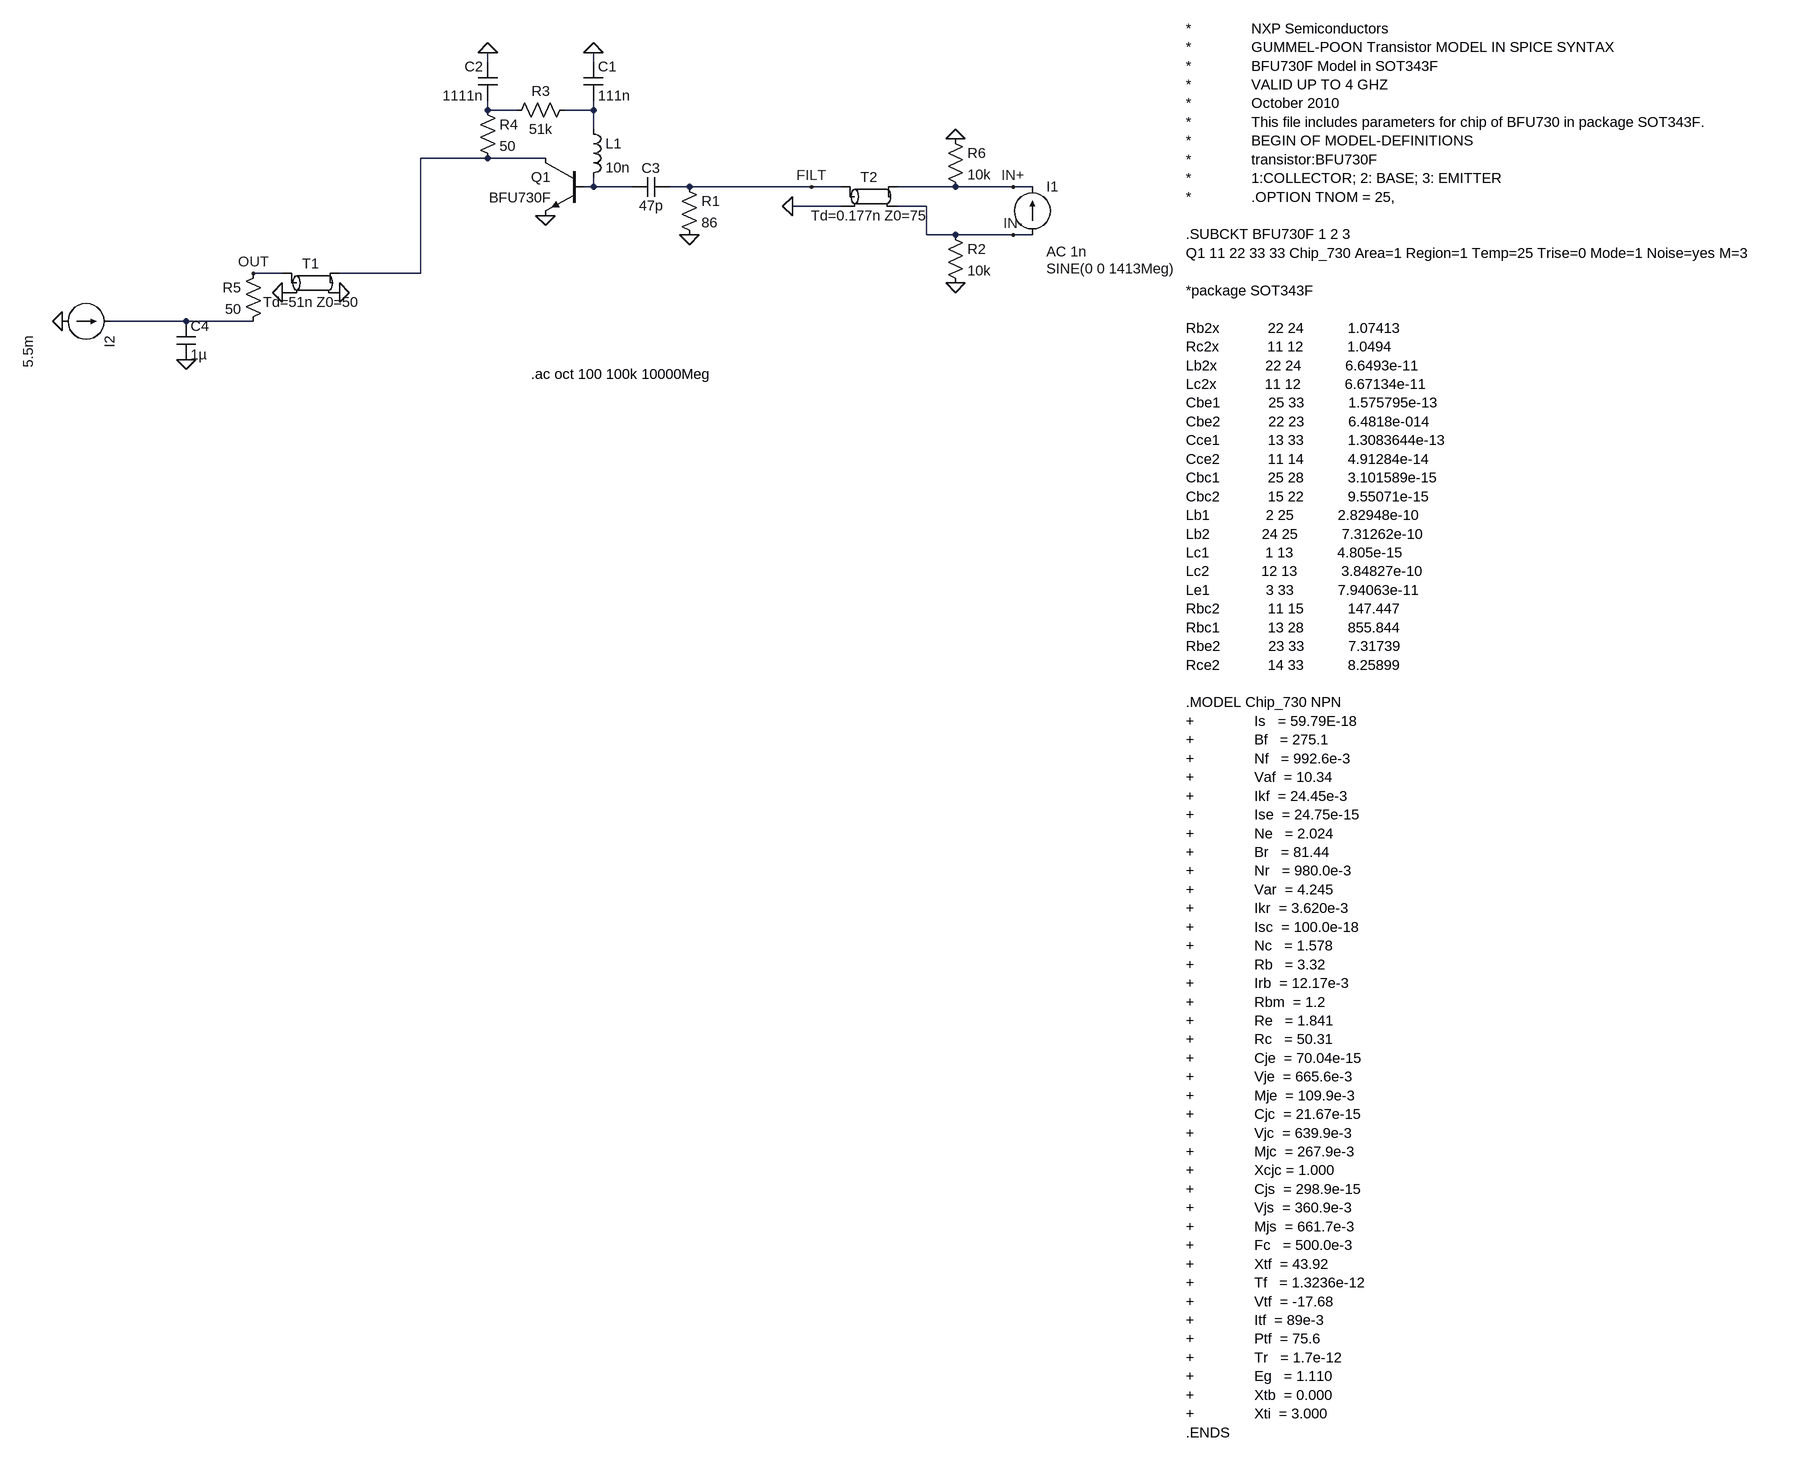
[diagram p0: schematic antenna_lna.asc]
antenna_lna.asc, the LTspice schematic file:
Version 4
SHEET 1 2580 2072
WIRE -304 -64 -304 -80
WIRE -128 -64 -128 -80
WIRE -304 16 -304 0
WIRE -256 16 -304 16
WIRE -128 16 -128 0
WIRE -128 16 -176 16
WIRE -128 48 -128 16
WIRE -304 96 -416 96
WIRE -208 96 -304 96
WIRE -128 144 -128 128
WIRE -128 144 -144 144
WIRE -64 144 -128 144
WIRE 32 144 0 144
WIRE 304 144 32 144
WIRE 352 144 304 144
WIRE 544 144 448 144
WIRE 640 144 544 144
WIRE 672 144 640 144
WIRE 352 176 272 176
WIRE 496 176 448 176
WIRE 496 224 496 176
WIRE 544 224 496 224
WIRE 640 224 544 224
WIRE 672 224 640 224
WIRE -672 288 -720 288
WIRE -416 288 -416 96
WIRE -416 288 -576 288
WIRE -832 368 -992 368
WIRE -720 368 -832 368
FLAG -208 192 0
FLAG -1072 368 0
FLAG -672 320 0
FLAG -576 320 0
FLAG -720 288 OUT
FLAG 304 144 FILT
FLAG 544 304 0
FLAG 544 64 0
FLAG 272 176 0
FLAG 32 224 0
FLAG -832 432 0
FLAG -128 -80 0
FLAG -304 -80 0
FLAG 640 144 IN+
FLAG 640 224 IN-
SYMBOL npn -144 96 M0
WINDOW 3 54 66 Left 2
SYMATTR InstName Q1
SYMATTR Value BFU730F
SYMATTR Prefix XN
SYMBOL res -704 272 M0
SYMATTR InstName R5
SYMATTR Value 50
SYMBOL tline -624 304 R0
SYMATTR InstName T1
SYMATTR Value Td=51n Z0=50
SYMBOL current 672 224 M180
WINDOW 0 24 80 Left 2
WINDOW 3 24 -56 Left 2
WINDOW 123 24 -28 Left 2
WINDOW 39 0 0 Left 0
SYMATTR InstName I1
SYMATTR Value SINE(0 0 1413Meg)
SYMATTR Value2 AC 1n
SYMBOL tline 400 160 R0
SYMATTR InstName T2
SYMATTR Value Td=0.177n Z0=75
SYMBOL res 528 208 R0
SYMATTR InstName R2
SYMATTR Value 10k
SYMBOL res 528 48 R0
SYMATTR InstName R6
SYMATTR Value 10k
SYMBOL cap 0 128 R90
WINDOW 0 0 32 VBottom 2
WINDOW 3 32 32 VTop 2
SYMATTR InstName C3
SYMATTR Value 47p
SYMBOL res 16 128 R0
SYMATTR InstName R1
SYMATTR Value 86
SYMBOL cap -848 368 R0
SYMATTR InstName C4
SYMATTR Value 1µ
SYMBOL current -1072 368 M90
WINDOW 0 24 80 Left 2
WINDOW 3 24 -56 Left 2
WINDOW 123 24 -28 Left 2
WINDOW 39 0 0 Left 0
SYMATTR InstName I2
SYMATTR Value 5.5m
SYMBOL res -160 0 R90
WINDOW 0 0 56 VBottom 2
WINDOW 3 32 56 VTop 2
SYMATTR InstName R3
SYMATTR Value 51k
SYMBOL ind -144 32 R0
SYMATTR InstName L1
SYMATTR Value 10n
SYMBOL cap -144 -64 R0
SYMATTR InstName C1
SYMATTR Value 111n
SYMBOL cap -288 -64 M0
SYMATTR InstName C2
SYMATTR Value 1111n
SYMBOL res -320 0 R0
SYMATTR InstName R4
SYMATTR Value 50
TEXT 928 -120 Left 2 !*               NXP Semiconductors                                                                                                                              \n*               GUMMEL-POON Transistor MODEL IN SPICE SYNTAX                                                                    \n*               BFU730F Model in SOT343F                                                                                                        \n*               VALID UP TO 4 GHZ                                                                                               \n*               October 2010                                                                                                                                    \n*               This file includes parameters for chip of BFU730 in package SOT343F.\n*               BEGIN OF MODEL-DEFINITIONS                                                                                                                      \n*               transistor:BFU730F\n*               1:COLLECTOR; 2: BASE; 3: EMITTER                                                                                                                                                                                \n*               .OPTION TNOM = 25, \n \n.SUBCKT BFU730F 1 2 3                           \nQ1 11 22 33 33 Chip_730 Area=1 Region=1 Temp=25 Trise=0 Mode=1 Noise=yes M=3\n \n*package SOT343F                                \n \nRb2x            22 24           1.07413\nRc2x            11 12           1.0494\nLb2x            22 24           6.6493e-11\nLc2x            11 12           6.67134e-11\nCbe1            25 33           1.575795e-13\nCbe2            22 23           6.4818e-014\nCce1            13 33           1.3083644e-13\nCce2            11 14           4.91284e-14\nCbc1            25 28           3.101589e-15\nCbc2            15 22           9.55071e-15\nLb1              2 25           2.82948e-10\nLb2             24 25           7.31262e-10\nLc1              1 13           4.805e-15\nLc2             12 13           3.84827e-10\nLe1              3 33           7.94063e-11\nRbc2            11 15           147.447\nRbc1            13 28           855.844\nRbe2            23 33           7.31739\nRce2            14 33           8.25899                                                                                         \n                                                                                                                                                \n.MODEL Chip_730 NPN\n+               Is   = 59.79E-18 \n+               Bf   = 275.1 \n+               Nf   = 992.6e-3 \n+               Vaf  = 10.34  \n+               Ikf  = 24.45e-3 \n+               Ise  = 24.75e-15 \n+               Ne   = 2.024  \n+               Br   = 81.44  \n+               Nr   = 980.0e-3 \n+               Var  = 4.245  \n+               Ikr  = 3.620e-3 \n+               Isc  = 100.0e-18 \n+               Nc   = 1.578  \n+               Rb   = 3.32 \n+               Irb  = 12.17e-3\n+               Rbm  = 1.2 \n+               Re   = 1.841  \n+               Rc   = 50.31  \n+               Cje  = 70.04e-15 \n+               Vje  = 665.6e-3 \n+               Mje  = 109.9e-3 \n+               Cjc  = 21.67e-15 \n+               Vjc  = 639.9e-3 \n+               Mjc  = 267.9e-3 \n+               Xcjc = 1.000  \n+               Cjs  = 298.9e-15 \n+               Vjs  = 360.9e-3\n+               Mjs  = 661.7e-3 \n+               Fc   = 500.0e-3\n+               Xtf  = 43.92 \n+               Tf   = 1.3236e-12\n+               Vtf  = -17.68 \n+               Itf  = 89e-3 \n+               Ptf  = 75.6 \n+               Tr   = 1.7e-12 \n+               Eg   = 1.110  \n+               Xtb  = 0.000  \n+               Xti  = 3.000  \n.ENDS
TEXT -232 456 Left 2 !.ac oct 100 100k 10000Meg

The netlist it stands for:
* antenna_lna.asc
XQ1 N003 N004 0 BFU730F  ; pins C B E
R5 OUT N005 50
T1 OUT 0 N003 0 Td=51n Z0=50
I1 IN- IN+ SINE(0 0 1413Meg) AC 1n
T2 FILT 0 IN+ IN- Td=0.177n Z0=75
R2 IN- 0 10k
R6 0 IN+ 10k
C3 FILT N004 47p
R1 FILT 0 86
C4 N005 0 1µ
I2 0 N005 5.5m
R3 N002 N001 51k
L1 N002 N004 10n
C1 0 N002 111n
C2 0 N001 1111n
R4 N001 N003 50
*               NXP Semiconductors
*               GUMMEL-POON Transistor MODEL IN SPICE SYNTAX
*               BFU730F Model in SOT343F
*               VALID UP TO 4 GHZ
*               October 2010
*               This file includes parameters for chip of BFU730 in package SOT343F.
*               BEGIN OF MODEL-DEFINITIONS
*               transistor:BFU730F
*               1:COLLECTOR; 2: BASE; 3: EMITTER
*               .OPTION TNOM = 25,
.SUBCKT BFU730F 1 2 3
Q1 11 22 33 33 Chip_730 Area=1 Region=1 Temp=25 Trise=0 Mode=1 Noise=yes M=3
*package SOT343F
Rb2x            22 24           1.07413
Rc2x            11 12           1.0494
Lb2x            22 24           6.6493e-11
Lc2x            11 12           6.67134e-11
Cbe1            25 33           1.575795e-13
Cbe2            22 23           6.4818e-014
Cce1            13 33           1.3083644e-13
Cce2            11 14           4.91284e-14
Cbc1            25 28           3.101589e-15
Cbc2            15 22           9.55071e-15
Lb1              2 25           2.82948e-10
Lb2             24 25           7.31262e-10
Lc1              1 13           4.805e-15
Lc2             12 13           3.84827e-10
Le1              3 33           7.94063e-11
Rbc2            11 15           147.447
Rbc1            13 28           855.844
Rbe2            23 33           7.31739
Rce2            14 33           8.25899
.MODEL Chip_730 NPN
+               Is   = 59.79E-18
+               Bf   = 275.1
+               Nf   = 992.6e-3
+               Vaf  = 10.34
+               Ikf  = 24.45e-3
+               Ise  = 24.75e-15
+               Ne   = 2.024
+               Br   = 81.44
+               Nr   = 980.0e-3
+               Var  = 4.245
+               Ikr  = 3.620e-3
+               Isc  = 100.0e-18
+               Nc   = 1.578
+               Rb   = 3.32
+               Irb  = 12.17e-3
+               Rbm  = 1.2
+               Re   = 1.841
+               Rc   = 50.31
+               Cje  = 70.04e-15
+               Vje  = 665.6e-3
+               Mje  = 109.9e-3
+               Cjc  = 21.67e-15
+               Vjc  = 639.9e-3
+               Mjc  = 267.9e-3
+               Xcjc = 1.000
+               Cjs  = 298.9e-15
+               Vjs  = 360.9e-3
+               Mjs  = 661.7e-3
+               Fc   = 500.0e-3
+               Xtf  = 43.92
+               Tf   = 1.3236e-12
+               Vtf  = -17.68
+               Itf  = 89e-3
+               Ptf  = 75.6
+               Tr   = 1.7e-12
+               Eg   = 1.110
+               Xtb  = 0.000
+               Xti  = 3.000
.ENDS
.ac oct 100 100k 10000Meg
.backanno
.end